# EAGLE design PowerBoard-v1.1 (EAGLE 7.6.0)
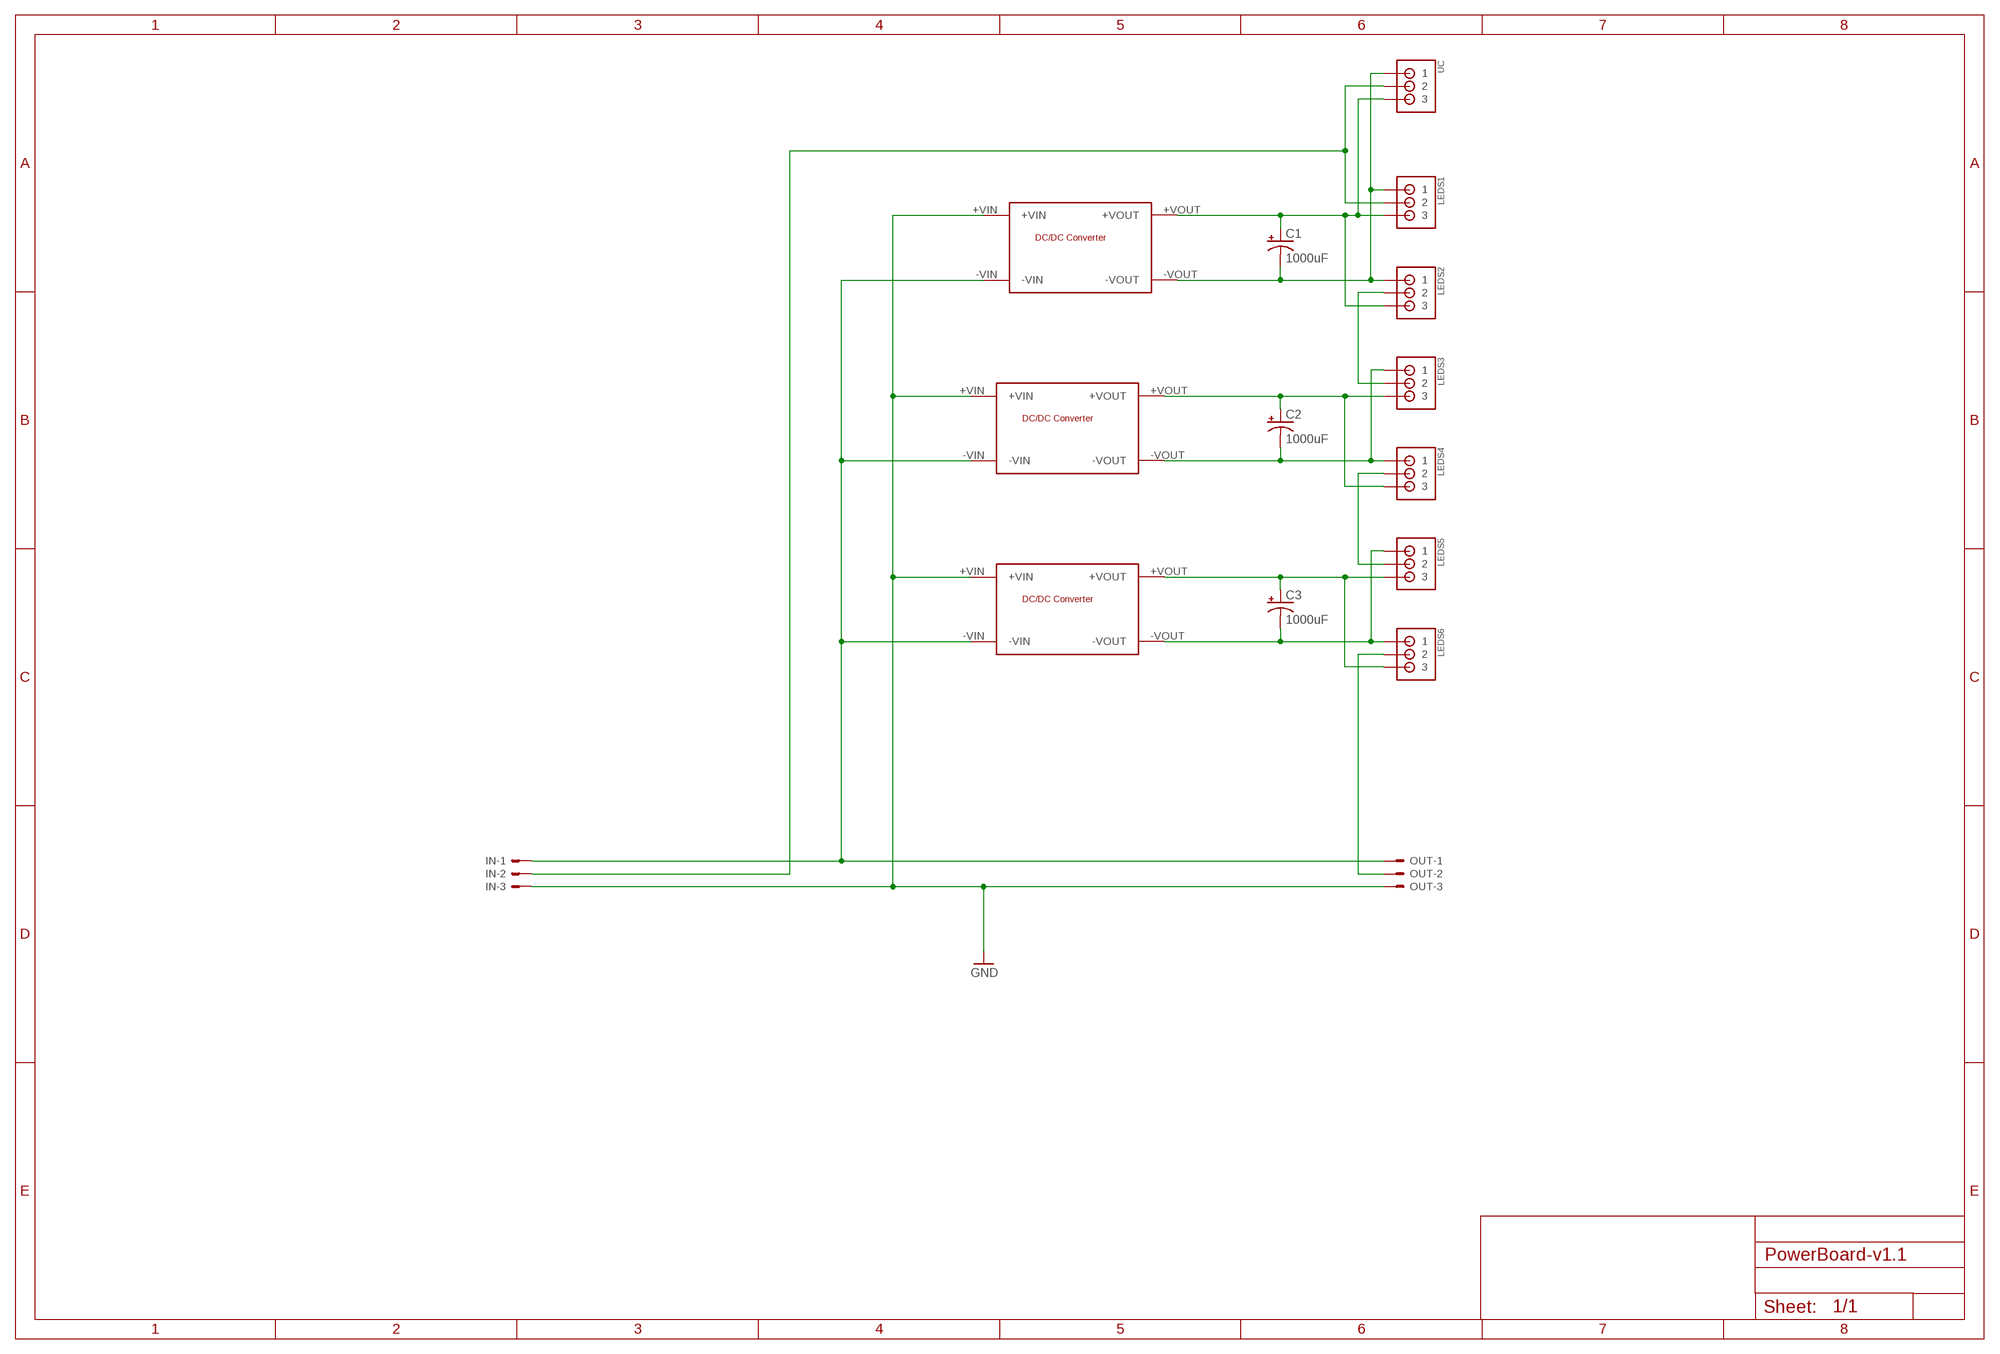
[diagram p0: schematic, sheet 1]

## Parts
C1  1000uF  CAP_POLPTH4  [CPOL-RADIAL-1000UF-25V]
C2  1000uF  CAP_POLPTH4  [CPOL-RADIAL-1000UF-25V]
C3  1000uF  CAP_POLPTH4  [CPOL-RADIAL-1000UF-25V]
IN  22-23-2031  [22-23-2031]
LEDS1  JST-XA-03-PIN  [JST-XA-03]
LEDS2  JST-XA-03-PIN  [JST-XA-03]
LEDS3  JST-XA-03-PIN  [JST-XA-03]
LEDS4  JST-XA-03-PIN  [JST-XA-03]
LEDS5  JST-XA-03-PIN  [JST-XA-03]
LEDS6  JST-XA-03-PIN  [JST-XA-03]
OUT  22-23-2031  [22-23-2031]
U$1  DC-DC-CONVERTER  [MP1584EN-BUCK-CONVERTER]
U$2  DC-DC-CONVERTER  [MP1584EN-BUCK-CONVERTER]
U$3  DC-DC-CONVERTER  [MP1584EN-BUCK-CONVERTER]
UC  JST-XA-03-PIN  [JST-XA-03]

## Nets
GND: IN.3 OUT.3 U$1.+VIN U$2.+VIN U$3.+VIN
N$1: IN.1 OUT.1 U$1.-VIN U$2.-VIN U$3.-VIN
N$3: C1.- LEDS1.1 LEDS2.1 U$1.-VOUT UC.1
N$4: C1.+ LEDS1.3 LEDS2.3 U$1.+VOUT UC.3
N$5: C2.+ LEDS3.3 LEDS4.3 U$2.+VOUT
N$6: C2.- LEDS3.1 LEDS4.1 U$2.-VOUT
N$8: C3.+ LEDS5.3 LEDS6.3 U$3.+VOUT
N$9: C3.- LEDS5.1 LEDS6.1 U$3.-VOUT
N$10: IN.2 LEDS1.2 UC.2
N$11: LEDS2.2 LEDS3.2
N$12: LEDS4.2 LEDS5.2
N$13: LEDS6.2 OUT.2

## Library data of the parts
C1-C3 = SparkFun-Capacitors:CAP_POL: Capacitor Polarized These are standard SMD and PTH capacitors. Normally 10uF, 47uF, and 100uF in electrolytic and tantalum varieties. Always verify the external diameter of the through hole cap, it varies with capacity, voltage, and manufacturer. The EIA devices should be standard.
IN OUT = con-molex:22-23-2031: .100" (2.54mm) Center Header - 3 Pin; MF: MOLEX; MPN: 22-23-2031; OC_FARNELL: 1462950; OC_NEWARK: 30C0862
LEDS1-LEDS6 UC = abw:JST-XA-03-PIN: JST XA Connector 3 Pin Wire to board connector. Pitch: 2.54 mm, (0.100") Number of pins: 3
U$1-U$3 = abw:DC-DC-CONVERTER

## Board
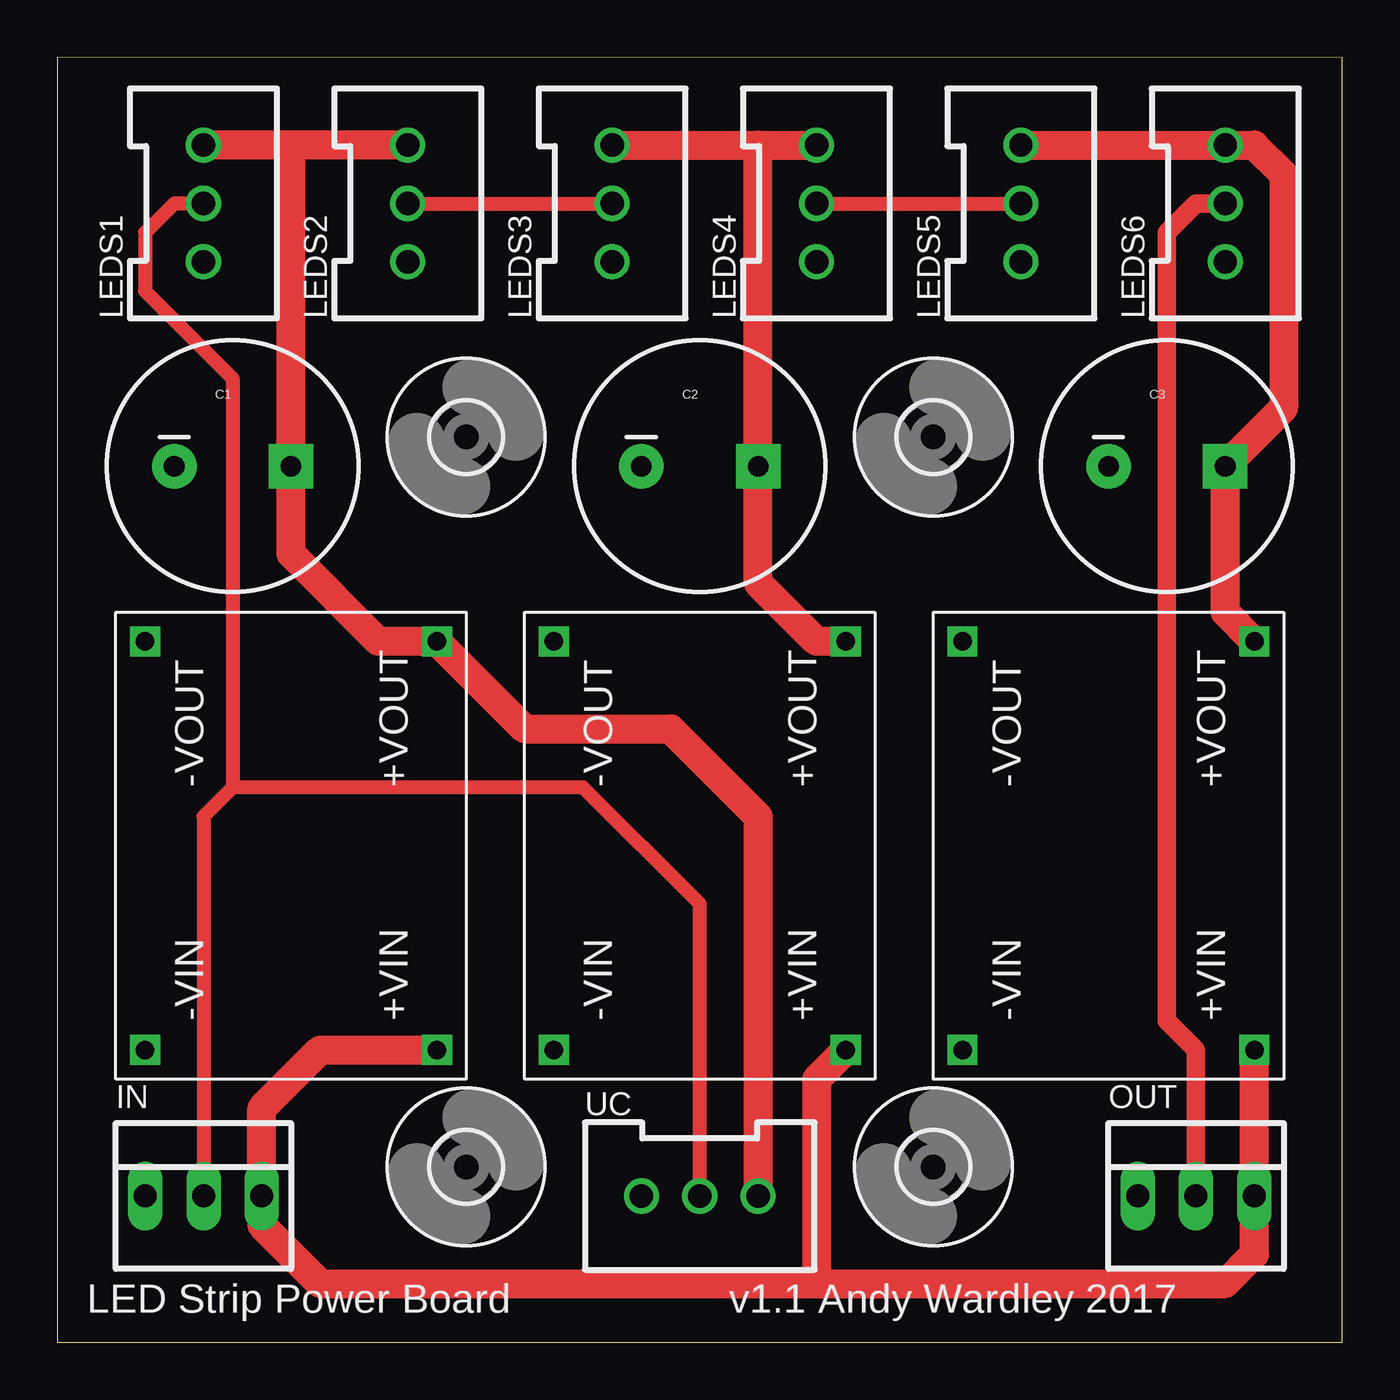
[diagram p1: board, top side]
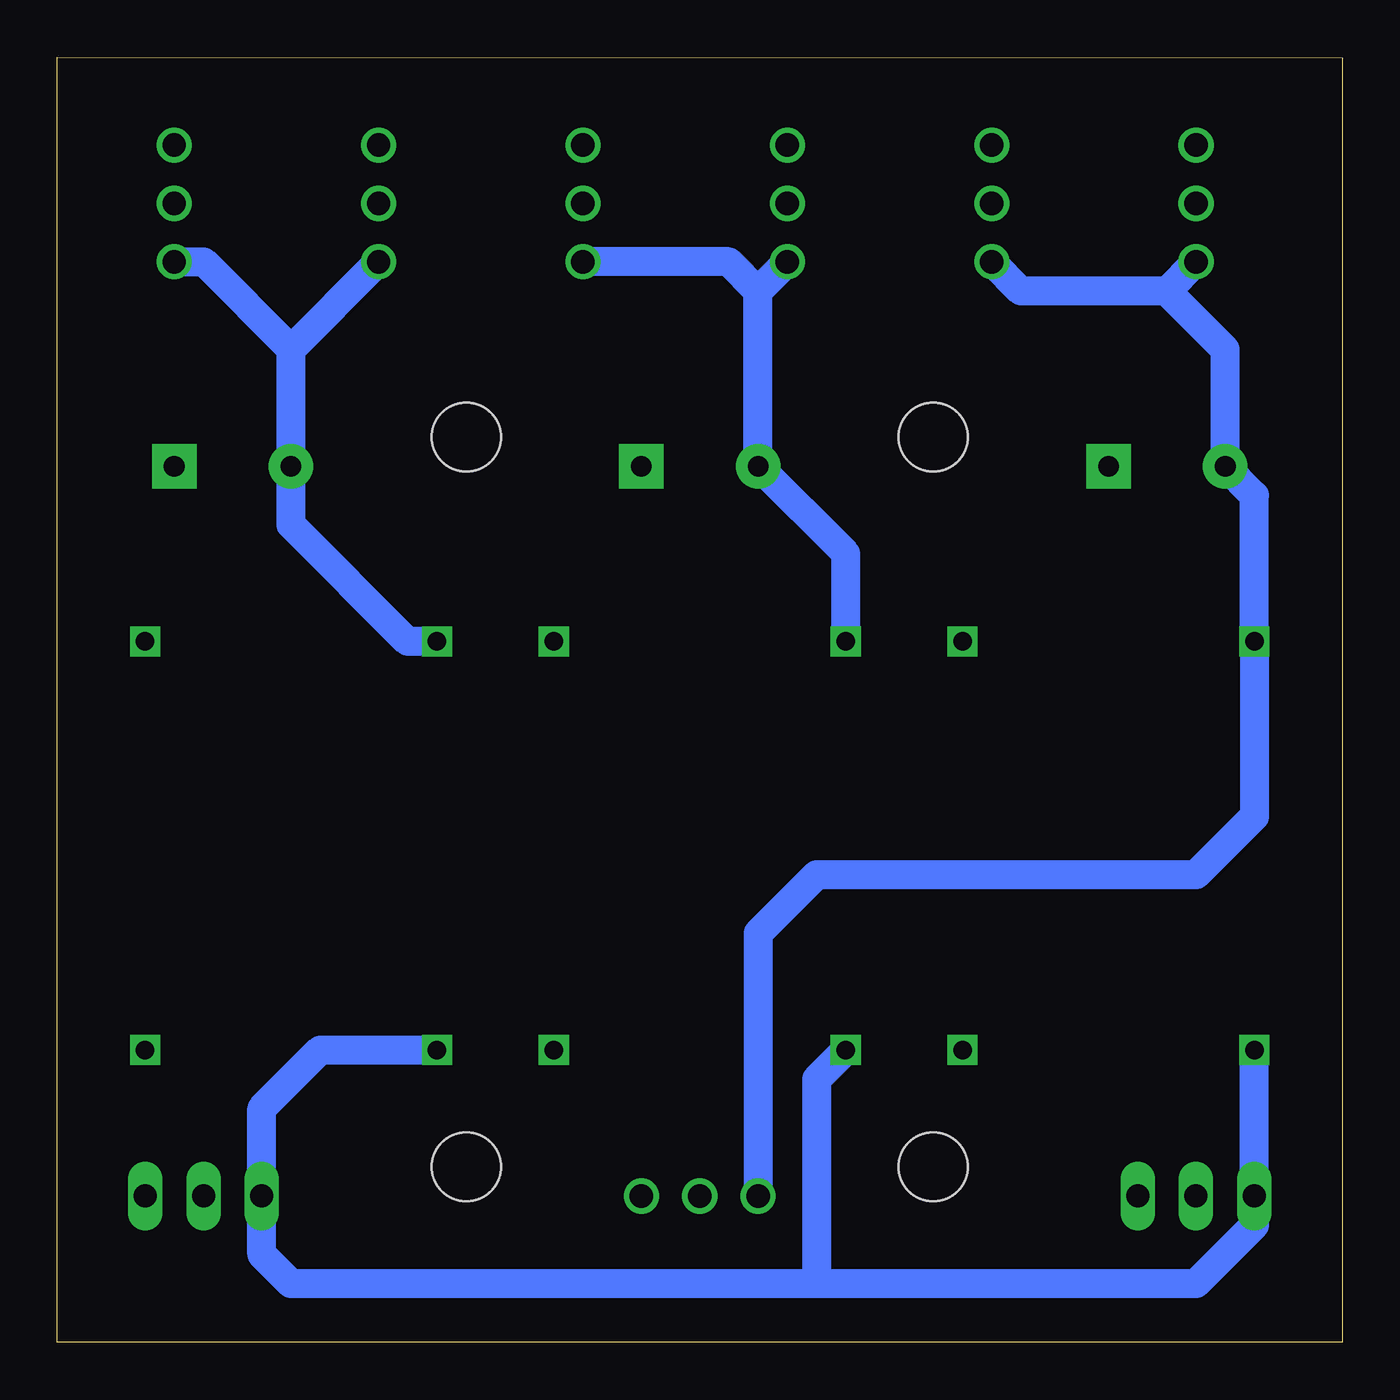
[diagram p2: board, bottom side, seen from below]

Size 55.88 x 55.88 mm. Coordinates in mm from the lower left corner, seen from the top.
Outline: 0,0 55.88,0 55.88,55.88 0,55.87 0,0
Copper layers (1*16): Top 0.035mm / dielectric 1.5mm / Bottom 0.035mm
Design rules "default": minimum track width 10mil, minimum drill 24mil, track to track 8mil, track to pad 8mil, pad to pad 8mil, via to via 8mil, smd to smd 8mil, copper to edge 40mil, drill to drill 8mil, minimum pad ring 10mil, minimum via ring 8mil, stop-mask expansion 4mil, vias tented up to drill 0mil, thermal gap 10mil

### Footprints (pad centres in the part's own frame; a part is rotated, then mirrored left to right if it is on the bottom)
CPOL-RADIAL-1000UF-25V = drill 0.9 pad 1.93 square: + 2.54,0 | drill 0.9 pad 1.93: - -2.54,0
22-23-2031 = drill 1 long: 1 -2.54,0; 2 0,0; 3 2.54,0
JST-XA-03 = drill 1.016: 1 -2.54,0; 2 0,0; 3 2.54,0
MP1584EN-BUCK-CONVERTER = drill 0.8 square: +VIN 0,0; +VOUT 17.78,0; -VIN 0,12.7; -VOUT 17.78,12.7
3,0 = hole 3: 0,0

### Placement (x,y rotation side)
C1  7.62,38.1 0 top
C2  27.94,38.1 0 top
C3  48.26,38.1 0 top
IN  6.35,6.35 0 top
LEDS1  6.35,49.53 90 top
LEDS2  15.24,49.53 90 top
LEDS3  24.13,49.53 90 top
LEDS4  33.02,49.53 90 top
LEDS5  41.91,49.53 90 top
LEDS6  50.8,49.53 90 top
OUT  49.53,6.35 0 top
U$1  16.51,12.7 90 top
U$2  34.29,12.7 90 top
U$3  52.07,12.7 90 top
U$4  [3,0]  38.1,39.37 0 top
U$5  [3,0]  17.78,39.37 0 top
U$6  [3,0]  17.78,7.62 0 top
U$7  [3,0]  38.1,7.62 0 top
UC  27.94,6.35 0 top

### Tracks (layer width: path | path; a pad name or v marks a point on that pad's centre or on a via)
GND
  Top 1.27: U$3.+VIN OUT.3 52.07,3.81 50.8,2.54 33.02,2.54 | 33.02,2.54 11.43,2.54 8.89,5.08 IN.3 8.89,10.16 11.43,12.7 U$1.+VIN | U$2.+VIN 33.02,11.43 33.02,2.54
N$1
  Bottom 1.27: 22.86,2.54 6.35,2.54 3.81,5.08 IN.1 U$1.-VIN | 22.86,2.54 45.72,2.54 46.99,3.81 OUT.1 46.99,10.16 44.45,12.7 U$3.-VIN | U$2.-VIN 22.86,11.43 22.86,2.54
N$3
  Bottom 1.27: 7.62,45.72 5.08,43.18 C1.- 3.81,36.83 U$1.-VOUT 3.81,22.86 6.35,20.32 22.86,20.32 25.4,17.78 UC.1 | 7.62,45.72 13.97,45.72 LEDS2.1 | LEDS1.1 7.62,45.72
N$4
  Top 1.27: LEDS2.3 10.16,52.07 | 10.16,52.07 LEDS1.3 | 10.16,52.07 C1.+ 10.16,34.29 13.97,30.48 U$1.+VOUT 20.32,26.67 26.67,26.67 30.48,22.86 UC.3
N$5
  Top 1.27: U$2.+VOUT 33.02,30.48 30.48,33.02 C2.+ 30.48,52.07 | LEDS3.3 30.48,52.07 | 30.48,52.07 LEDS4.3
N$6
  Bottom 1.27: U$2.-VOUT 21.59,34.29 C2.- 25.4,45.72 | 25.4,45.72 26.67,46.99 LEDS4.1 | LEDS3.1 25.4,45.72
N$8
  Top 1.27: U$3.+VOUT 50.8,31.75 C3.+ 53.34,40.64 53.34,50.8 52.07,52.07 LEDS6.3 LEDS5.3
N$9
  Bottom 1.27: U$3.-VOUT 40.64,30.48 45.72,35.56 C3.- 45.72,43.18 | 45.72,43.18 LEDS5.1 | LEDS6.1 49.53,46.99 45.72,43.18
N$10
  Top 0.61: LEDS1.2 5.08,49.53 3.81,48.26 3.81,45.72 7.62,41.91 7.62,24.13 | 7.62,24.13 6.35,22.86 IN.2 | UC.2 27.94,19.05 22.86,24.13 7.62,24.13
N$11
  Top 0.61: LEDS2.2 LEDS3.2
N$12
  Top 0.61: LEDS4.2 LEDS5.2
N$13
  Top 0.813: LEDS6.2 49.53,49.53 48.26,48.26 48.26,13.97 49.53,12.7 OUT.2

### Text on the board
tPlace: v1.1 Andy Wardley 2017
tNames: LED Strip Power Board